# Altium schematic sheet LED_v2.schdoc
size A
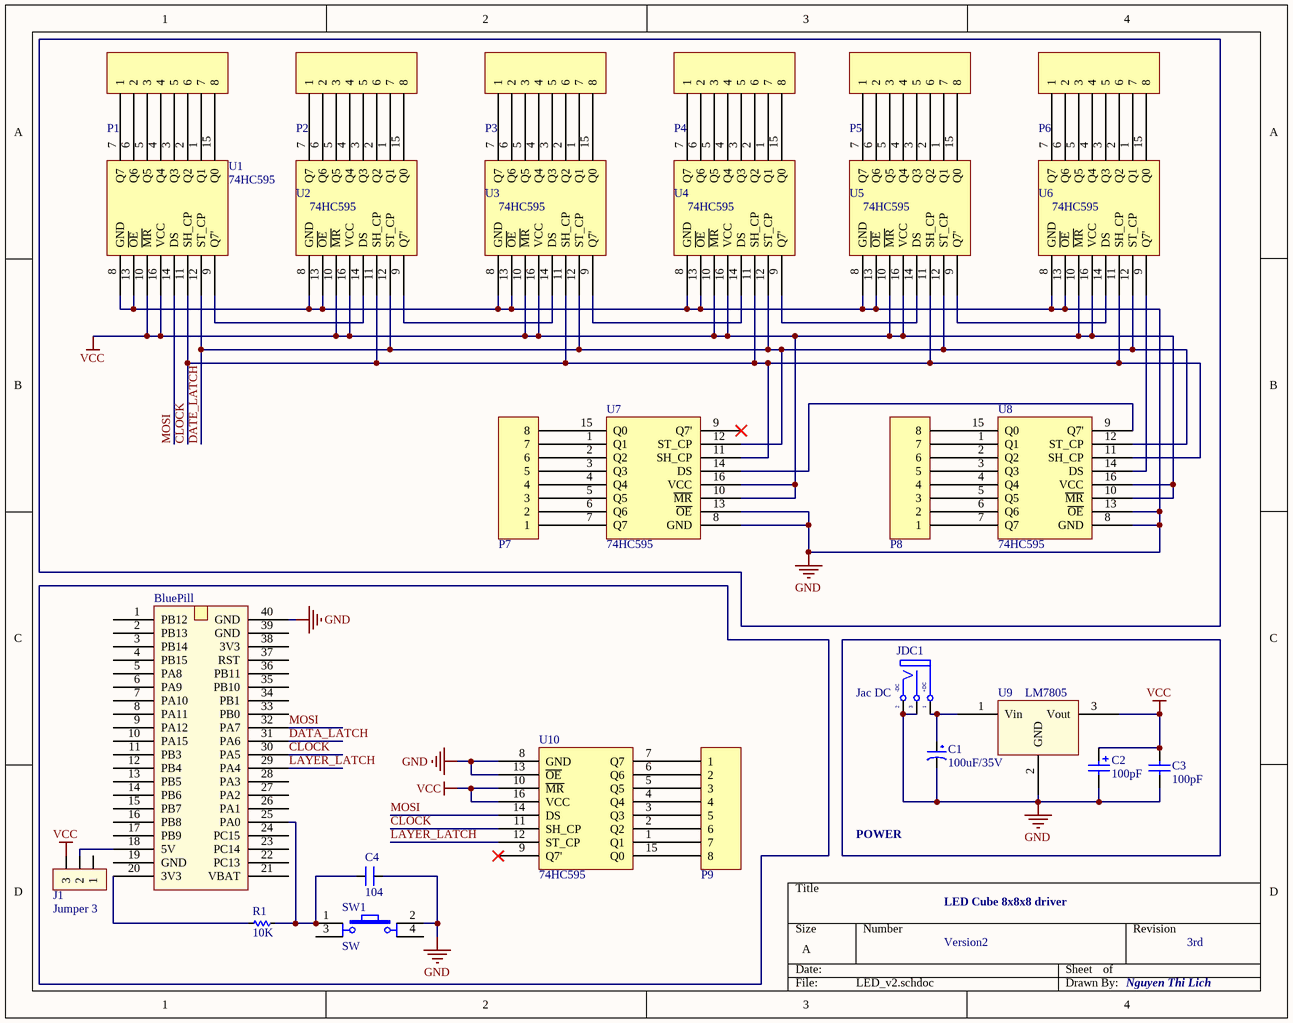
[diagram p0: LED_v2.schdoc]

## Parts
BluePill  BluePill  [BluePill]  (value not drawn)
C1  100uF/35V  [CP1.5/3.4]
C2  value 100pF  [CAP ALU SIZE B]  (hidden comment: Cap Pol SMD)
C3  value 100pF  [CAP-SM-0805]  (hidden comment: Cap Non-Pol SMD)
C4  104  [SM-0805]
J1  Jumper 3  [JP3]
JDC1  Jac DC  [DC0]
P1  Header 8  [JP8]  (value not drawn)
P2  Header 8  [JP8]  (value not drawn)
P3  Header 8  [JP8]  (value not drawn)
P4  Header 8  [JP8]  (value not drawn)
P5  Header 8  [JP8]  (value not drawn)
P6  Header 8  [JP8]  (value not drawn)
P7  Header 8  [JP8]  (value not drawn)
P8  Header 8  [JP8]  (value not drawn)
P9  Header 8  [JP8]  (value not drawn)
R1  10K  [RES-SMD-0805]
SW1  SW  [SW4]
U1  74HC595  [so16]
U2  74HC595  [so16]
U3  74HC595  [so16]
U4  74HC595  [so16]
U5  74HC595  [so16]
U6  74HC595  [so16]
U7  74HC595  [so16]
U8  74HC595  [so16]
U9  LM7805  [TO252-123]
U10  74HC595  [so16]

## Nets
GND: BluePill.40(GND) C1.2 C2.2 C3.1 C4.2 JDC1.2(TN) JDC1.3(S) SW1.2 U1.8(GND) U1.13(~{OE}) U2.8(GND) U2.13(~{OE}) U3.8(GND) U3.13(~{OE}) U4.8(GND) U4.13(~{OE}) U5.8(GND) U5.13(~{OE}) U6.8(GND) U6.13(~{OE}) U7.8(GND) U7.13(~{OE}) U8.8(GND) U8.13(~{OE}) U9.2(GND) U10.8(GND) U10.13(~{OE})
VCC: C2.1 C3.2 J1.3 U1.10(~{MR}) U1.16(VCC) U2.10(~{MR}) U2.16(VCC) U3.10(~{MR}) U3.16(VCC) U4.10(~{MR}) U4.16(VCC) U5.10(~{MR}) U5.16(VCC) U6.10(~{MR}) U6.16(VCC) U7.10(~{MR}) U7.16(VCC) U8.10(~{MR}) U8.16(VCC) U9.3(Vout) U10.10(~{MR}) U10.16(VCC)
CLOCK: BluePill.30(PA5) U1.11(SH_CP) U2.11(SH_CP) U3.11(SH_CP) U4.11(SH_CP) U5.11(SH_CP) U6.11(SH_CP) U7.11(SH_CP) U8.11(SH_CP) U10.11(SH_CP)
DATA_LATCH: BluePill.31(PA6)
DATE_LATCH: U1.12(ST_CP) U2.12(ST_CP) U3.12(ST_CP) U4.12(ST_CP) U5.12(ST_CP) U6.12(ST_CP) U7.12(ST_CP) U8.12(ST_CP)
LAYER_LATCH: BluePill.29(PA4) U10.12(ST_CP)
MOSI: BluePill.32(PA7) U1.14(DS) U10.14(DS)
NetBluePill_18: BluePill.18(5V) J1.2
NetBluePill_20: BluePill.20(3V3) R1.2
NetBluePill_25: BluePill.25(PA0) C4.1 R1.1 SW1.1
NetC1_1: C1.1 JDC1.1(T) U9.1(Vin)
NetP1_1: P1.1 U1.7(Q7)
NetP1_2: P1.2 U1.6(Q6)
NetP1_3: P1.3 U1.5(Q5)
NetP1_4: P1.4 U1.4(Q4)
NetP1_5: P1.5 U1.3(Q3)
NetP1_6: P1.6 U1.2(Q2)
NetP1_7: P1.7 U1.1(Q1)
NetP1_8: P1.8 U1.15(Q0)
NetP2_1: P2.1 U2.7(Q7)
NetP2_2: P2.2 U2.6(Q6)
NetP2_3: P2.3 U2.5(Q5)
NetP2_4: P2.4 U2.4(Q4)
NetP2_5: P2.5 U2.3(Q3)
NetP2_6: P2.6 U2.2(Q2)
NetP2_7: P2.7 U2.1(Q1)
NetP2_8: P2.8 U2.15(Q0)
NetP3_1: P3.1 U3.7(Q7)
NetP3_2: P3.2 U3.6(Q6)
NetP3_3: P3.3 U3.5(Q5)
NetP3_4: P3.4 U3.4(Q4)
NetP3_5: P3.5 U3.3(Q3)
NetP3_6: P3.6 U3.2(Q2)
NetP3_7: P3.7 U3.1(Q1)
NetP3_8: P3.8 U3.15(Q0)
NetP4_1: P4.1 U4.7(Q7)
NetP4_2: P4.2 U4.6(Q6)
NetP4_3: P4.3 U4.5(Q5)
NetP4_4: P4.4 U4.4(Q4)
NetP4_5: P4.5 U4.3(Q3)
NetP4_6: P4.6 U4.2(Q2)
NetP4_7: P4.7 U4.1(Q1)
NetP4_8: P4.8 U4.15(Q0)
NetP5_1: P5.1 U5.7(Q7)
NetP5_2: P5.2 U5.6(Q6)
NetP5_3: P5.3 U5.5(Q5)
NetP5_4: P5.4 U5.4(Q4)
NetP5_5: P5.5 U5.3(Q3)
NetP5_6: P5.6 U5.2(Q2)
NetP5_7: P5.7 U5.1(Q1)
NetP5_8: P5.8 U5.15(Q0)
NetP6_1: P6.1 U6.7(Q7)
NetP6_2: P6.2 U6.6(Q6)
NetP6_3: P6.3 U6.5(Q5)
NetP6_4: P6.4 U6.4(Q4)
NetP6_5: P6.5 U6.3(Q3)
NetP6_6: P6.6 U6.2(Q2)
NetP6_7: P6.7 U6.1(Q1)
NetP6_8: P6.8 U6.15(Q0)
NetP7_1: P7.1 U7.7(Q7)
NetP7_2: P7.2 U7.6(Q6)
NetP7_3: P7.3 U7.5(Q5)
NetP7_4: P7.4 U7.4(Q4)
NetP7_5: P7.5 U7.3(Q3)
NetP7_6: P7.6 U7.2(Q2)
NetP7_7: P7.7 U7.1(Q1)
NetP7_8: P7.8 U7.15(Q0)
NetP8_1: P8.1 U8.7(Q7)
NetP8_2: P8.2 U8.6(Q6)
NetP8_3: P8.3 U8.5(Q5)
NetP8_4: P8.4 U8.4(Q4)
NetP8_5: P8.5 U8.3(Q3)
NetP8_6: P8.6 U8.2(Q2)
NetP8_7: P8.7 U8.1(Q1)
NetP8_8: P8.8 U8.15(Q0)
NetP9_1: P9.1 U10.7(Q7)
NetP9_2: P9.2 U10.6(Q6)
NetP9_3: P9.3 U10.5(Q5)
NetP9_4: P9.4 U10.4(Q4)
NetP9_5: P9.5 U10.3(Q3)
NetP9_6: P9.6 U10.2(Q2)
NetP9_7: P9.7 U10.1(Q1)
NetP9_8: P9.8 U10.15(Q0)
NetU1_9: U1.9(Q7') U2.14(DS)
NetU2_9: U2.9(Q7') U3.14(DS)
NetU3_9: U3.9(Q7') U4.14(DS)
NetU4_9: U4.9(Q7') U5.14(DS)
NetU5_9: U5.9(Q7') U6.14(DS)
NetU6_9: U6.9(Q7') U8.14(DS)
NetU7_14: U7.14(DS) U8.9(Q7')

Not connected (* = marked no-connect by the designer): BluePill 1(PB12) 2(PB13) 3(PB14) 4(PB15) 5(PA8) 6(PA9) 7(PA10) 8(PA11) 9(PA12) 10(PA15) 11(PB3) 12(PB4) 13(PB5) 14(PB6) 15(PB7) 16(PB8) 17(PB9) 19(GND) 21(VBAT) 22(PC13) 23(PC14) 24(PC15) 26(PA1) 27(PA2) 28(PA3) 33(PB0) 34(PB1) 35(PB10) 36(PB11) 37(RST) 38(3V3) 39(GND); J1 1; SW1 3 4; U7 9(Q7')*; U10 9(Q7')*

## Notes on the sheet
- POWER
- LED Cube 8x8x8 driver
- Version2
- 3rd
- Nguyen Thi Lich
- (in symbol DCIN) -DC; +DC

## Library data of the parts
BluePill = BluePill_stm32: stm32f103c8t6
C1 = CP3: Cap 100uF/35V - 470uF/16V; Value: 100uF/35V/50V; Description 1: 1000uF/6,3V - 470uF/16V - 330uF - 25V; Description 2: 220uF/35V - 100uF/50V - 63V - 4,7uF/200V; Description 3: 22uF => 33uF100V - 3,3uF => 4,7uF/250V; Description 4: 2,2uF =>3,3uF/350 - 2,2uF/400V - 1uF/450V
C2 = Cap Pol SMD: Polarized Capacitor (Radial)
C3 = Cap Non-Pol SMD: Capacitor
C4 = CM: Cap SMD; Value: 103
J1 = JP3: Value: J3
JDC1 = DCIN: Jac DC input; Value: Jac DC
P1-P9 = Header 8: Header, 8-Pin; LatestRevisionDate: 17-Jul-2002; LatestRevisionNote: Re-released for DXP Platform.; Publisher: Altium Limited
R1 = Res-SMD: Resistor; Manufacturer: Generic Components; Class: Passive; Published: 08/06/2000; Publisher: Altium Hobart Technology Centre
SW1 = SW4: Switch button 4 pin; Value: Button chip 4 pin
U9 = LM78xx